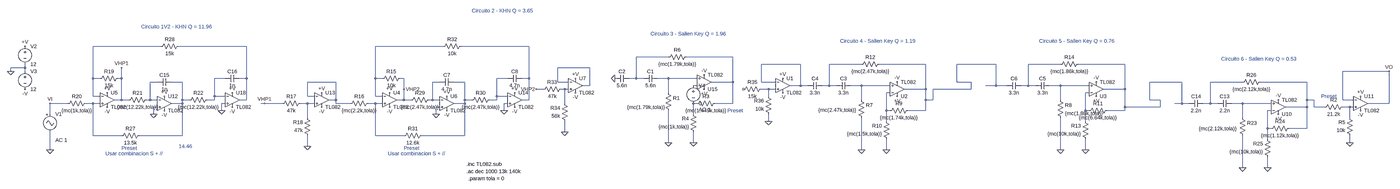
[diagram p0: schematic FiltroHP_N10_MC.asc, whole sheet]
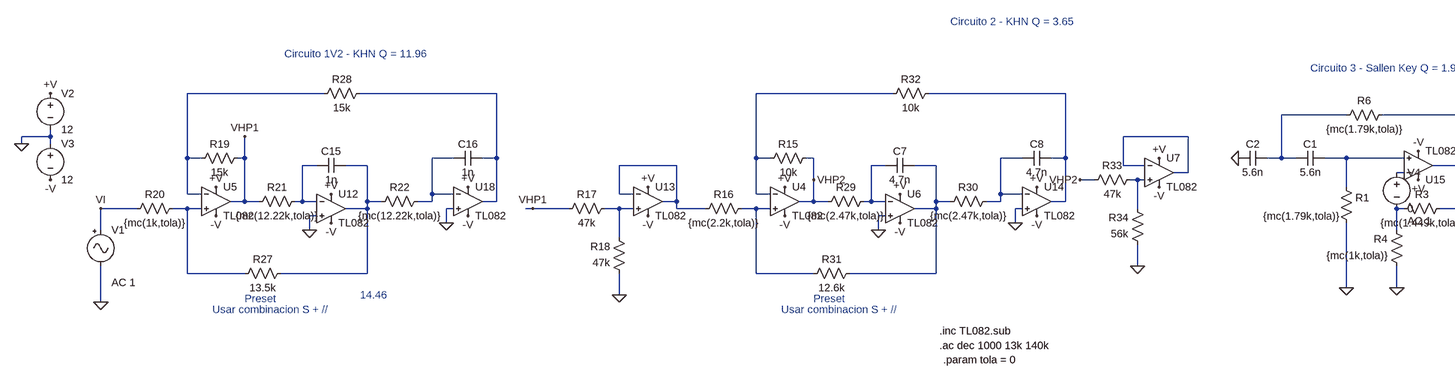
[diagram p1: schematic FiltroHP_N10_MC.asc, part, row 1 of 1, column 1 of 2]
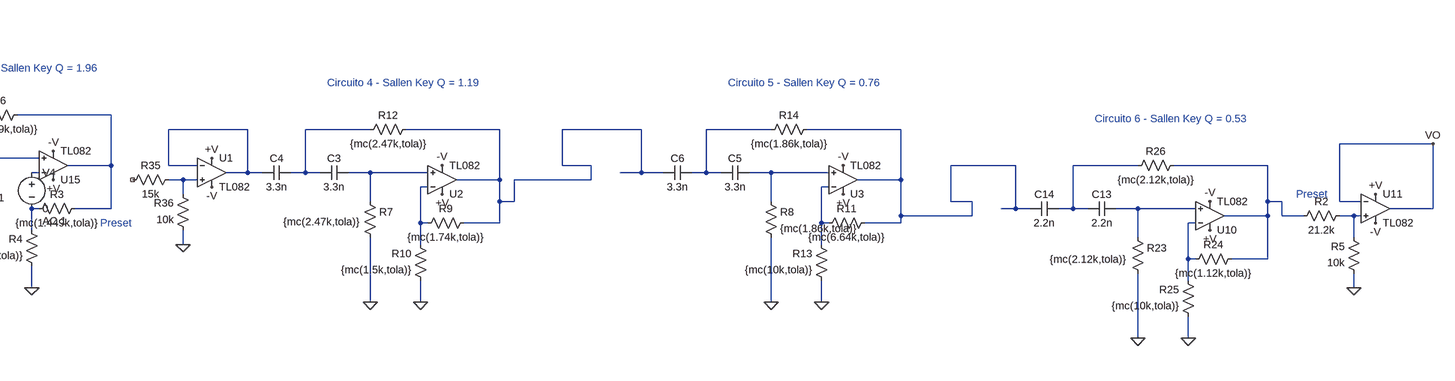
[diagram p2: schematic FiltroHP_N10_MC.asc, part, row 1 of 1, column 2 of 2]
FiltroHP_N10_MC.asc, the LTspice schematic file:
Version 4
SHEET 1 5208 1092
WIRE -912 0 -1216 0
WIRE -528 0 -832 0
WIRE 352 0 48 0
WIRE 736 0 432 0
WIRE 1360 48 1216 48
WIRE 1648 48 1440 48
WIRE 1952 80 1776 80
WIRE 2224 80 2080 80
WIRE 2512 80 2304 80
WIRE 2832 80 2656 80
WIRE 3120 80 2976 80
WIRE 3408 80 3200 80
WIRE -1520 96 -1520 80
WIRE -1520 96 -1584 96
WIRE 1008 96 864 96
WIRE -1584 112 -1584 96
WIRE -1520 112 -1520 96
WIRE 4656 112 4448 112
WIRE -1216 144 -1216 0
WIRE -1184 144 -1216 144
WIRE -1088 144 -1088 96
WIRE -1088 144 -1104 144
WIRE -624 144 -672 144
WIRE -528 144 -528 0
WIRE -528 144 -560 144
WIRE 48 144 48 0
WIRE 80 144 48 144
WIRE 176 144 160 144
WIRE 640 144 592 144
WIRE 736 144 736 0
WIRE 736 144 704 144
WIRE 1216 144 1216 48
WIRE 1216 144 1184 144
WIRE 1248 144 1216 144
WIRE 1360 144 1312 144
WIRE 1488 144 1360 144
WIRE -928 160 -960 160
WIRE -816 160 -864 160
WIRE -128 160 -256 160
WIRE 336 160 304 160
WIRE 448 160 400 160
WIRE 864 160 864 96
WIRE 912 160 864 160
WIRE 1648 160 1648 48
WIRE 1648 160 1552 160
WIRE 1776 160 1776 80
WIRE 1840 160 1776 160
WIRE 2656 160 2656 80
WIRE 2720 160 2656 160
WIRE 3728 160 3584 160
WIRE 4000 160 3856 160
WIRE 4288 160 4080 160
WIRE 1008 176 1008 96
WIRE 1008 176 976 176
WIRE 1488 176 1472 176
WIRE 1952 176 1952 80
WIRE 1952 176 1904 176
WIRE 1984 176 1952 176
WIRE 2080 176 2080 80
WIRE 2080 176 2048 176
WIRE 2112 176 2080 176
WIRE 2224 176 2176 176
WIRE 2352 176 2224 176
WIRE 2832 176 2832 80
WIRE 2832 176 2784 176
WIRE 2880 176 2832 176
WIRE 2976 176 2976 80
WIRE 2976 176 2944 176
WIRE 3008 176 2976 176
WIRE 3120 176 3072 176
WIRE 3248 176 3120 176
WIRE 176 192 176 144
WIRE 800 192 768 192
WIRE 896 192 880 192
WIRE 912 192 896 192
WIRE 1808 192 1776 192
WIRE 1840 192 1808 192
WIRE 2512 192 2512 80
WIRE 2512 192 2416 192
WIRE 2720 192 2720 160
WIRE 2720 192 2544 192
WIRE 3408 192 3408 80
WIRE 3408 192 3312 192
WIRE 1360 208 1360 144
WIRE 2352 208 2336 208
WIRE 3248 208 3232 208
WIRE -1216 224 -1216 144
WIRE -1184 224 -1216 224
WIRE -672 224 -672 144
WIRE -624 224 -672 224
WIRE -256 224 -256 160
WIRE -224 224 -256 224
WIRE 48 224 48 144
WIRE 80 224 48 224
WIRE 592 224 592 144
WIRE 640 224 592 224
WIRE 1808 224 1808 192
WIRE -1088 240 -1088 144
WIRE -1088 240 -1120 240
WIRE -1056 240 -1088 240
WIRE -960 240 -960 160
WIRE -960 240 -976 240
WIRE -928 240 -960 240
WIRE -816 240 -816 160
WIRE -784 240 -816 240
WIRE -672 240 -672 224
WIRE -672 240 -704 240
WIRE -528 240 -528 144
WIRE -528 240 -560 240
WIRE -128 240 -128 160
WIRE -128 240 -160 240
WIRE 176 240 176 192
WIRE 176 240 144 240
WIRE 208 240 176 240
WIRE 304 240 304 160
WIRE 304 240 288 240
WIRE 336 240 304 240
WIRE 448 240 448 160
WIRE 480 240 448 240
WIRE 592 240 592 224
WIRE 592 240 560 240
WIRE 736 240 736 144
WIRE 736 240 704 240
WIRE 2224 240 2224 176
WIRE 2512 240 2512 192
WIRE 2544 240 2544 192
WIRE 2544 240 2512 240
WIRE 3120 240 3120 176
WIRE 3584 240 3584 160
WIRE 3632 240 3584 240
WIRE 4288 240 4288 160
WIRE 4320 240 4288 240
WIRE 4448 240 4448 112
WIRE 4496 240 4448 240
WIRE -1328 256 -1408 256
WIRE -1216 256 -1248 256
WIRE -1184 256 -1216 256
WIRE -816 256 -816 240
WIRE -816 256 -864 256
WIRE -624 256 -640 256
WIRE -448 256 -464 256
WIRE -368 256 -448 256
WIRE -256 256 -288 256
WIRE -224 256 -256 256
WIRE -128 256 -128 240
WIRE -64 256 -128 256
WIRE 48 256 16 256
WIRE 80 256 48 256
WIRE 448 256 448 240
WIRE 448 256 400 256
WIRE 640 256 624 256
WIRE 896 256 896 192
WIRE 1488 256 1472 256
WIRE 1648 256 1648 160
WIRE 1648 256 1568 256
WIRE 3728 256 3728 160
WIRE 3728 256 3696 256
WIRE 3760 256 3728 256
WIRE 3856 256 3856 160
WIRE 3856 256 3824 256
WIRE 3888 256 3856 256
WIRE 4000 256 3952 256
WIRE 4128 256 4000 256
WIRE 4656 256 4656 112
WIRE 4656 256 4560 256
WIRE -928 272 -944 272
WIRE 336 272 320 272
WIRE 3408 272 3408 192
WIRE 3632 272 3632 240
WIRE 3632 272 3408 272
WIRE 4288 272 4288 240
WIRE 4288 272 4192 272
WIRE 4320 272 4320 240
WIRE 4368 272 4320 272
WIRE 4480 272 4448 272
WIRE 4496 272 4480 272
WIRE -640 288 -640 256
WIRE 624 288 624 256
WIRE 2336 288 2336 208
WIRE 2352 288 2336 288
WIRE 2512 288 2512 240
WIRE 2512 288 2432 288
WIRE 3232 288 3232 208
WIRE 3248 288 3232 288
WIRE 3408 288 3408 272
WIRE 3408 288 3328 288
WIRE 4128 288 4112 288
WIRE -1408 304 -1408 256
WIRE -944 304 -944 272
WIRE 320 304 320 272
WIRE 1472 304 1472 256
WIRE -256 320 -256 256
WIRE 4000 320 4000 256
WIRE 4480 320 4480 272
WIRE 1808 336 1808 304
WIRE 2336 336 2336 288
WIRE 3232 336 3232 288
WIRE 4112 368 4112 288
WIRE 4128 368 4112 368
WIRE 4288 368 4288 272
WIRE 4288 368 4208 368
WIRE 896 384 896 336
WIRE -1216 400 -1216 256
WIRE -1088 400 -1216 400
WIRE -816 400 -816 256
WIRE -816 400 -1008 400
WIRE 48 400 48 256
WIRE 176 400 48 400
WIRE 448 400 448 256
WIRE 448 400 256 400
WIRE 4112 416 4112 368
WIRE 1360 432 1360 288
WIRE 1472 432 1472 384
WIRE 4480 432 4480 400
WIRE -256 448 -256 400
WIRE -1408 464 -1408 384
WIRE 2224 464 2224 320
WIRE 2336 464 2336 416
WIRE 3120 464 3120 320
WIRE 3232 464 3232 416
WIRE 4000 544 4000 400
WIRE 4112 544 4112 496
FLAG 1360 432 0
FLAG 1472 432 0
FLAG 2224 464 0
FLAG 2336 464 0
FLAG 3120 464 0
FLAG 3232 464 0
FLAG -1408 256 VI
FLAG 4000 544 0
FLAG 4112 544 0
FLAG -1408 464 0
FLAG -944 304 0
FLAG -640 288 0
FLAG 320 304 0
FLAG 624 288 0
FLAG 176 192 VHP2
FLAG 768 192 VHP2
FLAG -448 256 VHP1
FLAG 4656 112 VO
FLAG -1088 96 VHP1
FLAG -1584 112 0
FLAG -1520 0 +V
FLAG -1520 192 -V
FLAG -1152 208 +V
FLAG -896 224 +V
FLAG -592 208 +V
FLAG -1152 272 -V
FLAG -896 288 -V
FLAG -592 272 -V
FLAG -192 208 +V
FLAG -192 272 -V
FLAG 112 208 +V
FLAG 368 224 +V
FLAG 672 208 +V
FLAG 112 272 -V
FLAG 368 288 -V
FLAG 672 272 -V
FLAG 944 144 +V
FLAG 944 208 -V
FLAG 1520 192 +V
FLAG 1520 128 -V
FLAG 1872 144 +V
FLAG 1872 208 -V
FLAG 2384 224 +V
FLAG 2384 160 -V
FLAG 3280 224 +V
FLAG 3280 160 -V
FLAG 4160 240 -V
FLAG 4160 304 +V
FLAG 4528 224 +V
FLAG 4528 288 -V
FLAG 4480 432 0
FLAG -256 448 0
FLAG 896 384 0
FLAG 1808 336 0
FLAG 1120 144 0
SYMBOL cap 1312 128 R90
WINDOW 0 0 32 VBottom 2
WINDOW 3 32 32 VTop 2
SYMATTR InstName C1
SYMATTR Value 5.6n
SYMBOL cap 1184 128 R90
WINDOW 0 0 32 VBottom 2
WINDOW 3 32 32 VTop 2
SYMATTR InstName C2
SYMATTR Value 5.6n
SYMBOL res 1344 192 R0
WINDOW 3 -169 81 Left 2
SYMATTR Value {mc(1.79k,tola)}
SYMATTR InstName R1
SYMBOL res 1584 240 R90
WINDOW 0 0 56 VBottom 2
WINDOW 3 32 56 VTop 2
SYMATTR InstName R3
SYMATTR Value {mc(1.449k,tola)}
SYMBOL res 1488 400 R180
WINDOW 0 36 76 Left 2
WINDOW 3 36 40 Left 2
SYMATTR InstName R4
SYMATTR Value {mc(1k,tola)}
SYMBOL res 1344 64 R270
WINDOW 0 32 56 VTop 2
WINDOW 3 0 56 VBottom 2
SYMATTR InstName R6
SYMATTR Value {mc(1.79k,tola)}
SYMBOL cap 2176 160 R90
WINDOW 0 0 32 VBottom 2
WINDOW 3 32 32 VTop 2
SYMATTR InstName C3
SYMATTR Value 3.3n
SYMBOL cap 2048 160 R90
WINDOW 0 0 32 VBottom 2
WINDOW 3 32 32 VTop 2
SYMATTR InstName C4
SYMATTR Value 3.3n
SYMBOL res 2208 224 R0
WINDOW 3 -177 61 Left 2
SYMATTR Value {mc(2.47k,tola)}
SYMATTR InstName R7
SYMBOL res 2448 272 R90
WINDOW 0 0 56 VBottom 2
WINDOW 3 32 56 VTop 2
SYMATTR InstName R9
SYMATTR Value {mc(1.74k,tola)}
SYMBOL res 2352 432 R180
WINDOW 0 36 76 Left 2
WINDOW 3 36 40 Left 2
SYMATTR InstName R10
SYMATTR Value {mc(1.5k,tola)}
SYMBOL res 2208 96 R270
WINDOW 0 32 56 VTop 2
WINDOW 3 0 56 VBottom 2
SYMATTR InstName R12
SYMATTR Value {mc(2.47k,tola)}
SYMBOL cap 3072 160 R90
WINDOW 0 0 32 VBottom 2
WINDOW 3 32 32 VTop 2
SYMATTR InstName C5
SYMATTR Value 3.3n
SYMBOL cap 2944 160 R90
WINDOW 0 0 32 VBottom 2
WINDOW 3 32 32 VTop 2
SYMATTR InstName C6
SYMATTR Value 3.3n
SYMBOL res 3104 224 R0
SYMATTR InstName R8
SYMATTR Value {mc(1.86k,tola)}
SYMBOL res 3344 272 R90
WINDOW 0 0 56 VBottom 2
WINDOW 3 32 56 VTop 2
SYMATTR InstName R11
SYMATTR Value {mc(6.64k,tola)}
SYMBOL res 3248 432 R180
WINDOW 0 36 76 Left 2
WINDOW 3 36 40 Left 2
SYMATTR InstName R13
SYMATTR Value {mc(10k,tola)}
SYMBOL res 3104 96 R270
WINDOW 0 32 56 VTop 2
WINDOW 3 0 56 VBottom 2
SYMATTR InstName R14
SYMATTR Value {mc(1.86k,tola)}
SYMBOL cap 3952 240 R90
WINDOW 0 0 32 VBottom 2
WINDOW 3 32 32 VTop 2
SYMATTR InstName C13
SYMATTR Value 2.2n
SYMBOL cap 3824 240 R90
WINDOW 0 0 32 VBottom 2
WINDOW 3 32 32 VTop 2
SYMATTR InstName C14
SYMATTR Value 2.2n
SYMBOL res 3984 304 R0
WINDOW 3 -180 65 Left 2
SYMATTR Value {mc(2.12k,tola)}
SYMATTR InstName R23
SYMBOL res 4224 352 R90
WINDOW 0 0 56 VBottom 2
WINDOW 3 32 56 VTop 2
SYMATTR InstName R24
SYMATTR Value {mc(1.12k,tola)}
SYMBOL res 4128 512 R180
WINDOW 0 36 76 Left 2
WINDOW 3 36 40 Left 2
SYMATTR InstName R25
SYMATTR Value {mc(10k,tola)}
SYMBOL res 3984 176 R270
WINDOW 0 32 56 VTop 2
WINDOW 3 0 56 VBottom 2
SYMATTR InstName R26
SYMATTR Value {mc(2.12k,tola)}
SYMBOL Misc\\signal -1408 288 R0
WINDOW 123 24 132 Left 2
WINDOW 39 0 0 Left 2
SYMATTR Value2 AC 1
SYMATTR InstName V1
SYMATTR Value ""
SYMBOL res -1088 128 R90
WINDOW 0 0 56 VBottom 2
WINDOW 3 32 56 VTop 2
SYMATTR InstName R19
SYMATTR Value 15k
SYMBOL res -1232 240 R90
WINDOW 0 0 56 VBottom 2
WINDOW 3 32 56 VTop 2
SYMATTR InstName R20
SYMATTR Value {mc(1k,tola)}
SYMBOL res -960 224 R90
WINDOW 0 0 56 VBottom 2
WINDOW 3 32 56 VTop 2
SYMATTR InstName R21
SYMATTR Value {mc(12.22k,tola)}
SYMBOL cap -864 144 R90
WINDOW 0 0 32 VBottom 2
WINDOW 3 32 32 VTop 2
SYMATTR InstName C15
SYMATTR Value 1n
SYMBOL cap -560 128 R90
WINDOW 0 0 32 VBottom 2
WINDOW 3 32 32 VTop 2
SYMATTR InstName C16
SYMATTR Value 1n
SYMBOL res -688 224 R90
WINDOW 0 0 56 VBottom 2
WINDOW 3 32 56 VTop 2
SYMATTR InstName R22
SYMATTR Value {mc(12.22k,tola)}
SYMBOL res -992 384 R90
WINDOW 0 0 56 VBottom 2
WINDOW 3 32 56 VTop 2
SYMATTR InstName R27
SYMATTR Value 13.5k
SYMBOL res -816 -16 R90
WINDOW 0 0 56 VBottom 2
WINDOW 3 32 56 VTop 2
SYMATTR InstName R28
SYMATTR Value 15k
SYMBOL res 176 128 R90
WINDOW 0 0 56 VBottom 2
WINDOW 3 32 56 VTop 2
SYMATTR InstName R15
SYMATTR Value 10k
SYMBOL res 32 240 R90
WINDOW 0 0 56 VBottom 2
WINDOW 3 32 56 VTop 2
SYMATTR InstName R16
SYMATTR Value {mc(2.2k,tola)}
SYMBOL res 304 224 R90
WINDOW 0 0 56 VBottom 2
WINDOW 3 32 56 VTop 2
SYMATTR InstName R29
SYMATTR Value {mc(2.47k,tola)}
SYMBOL cap 400 144 R90
WINDOW 0 0 32 VBottom 2
WINDOW 3 32 32 VTop 2
SYMATTR InstName C7
SYMATTR Value 4.7n
SYMBOL cap 704 128 R90
WINDOW 0 0 32 VBottom 2
WINDOW 3 32 32 VTop 2
SYMATTR InstName C8
SYMATTR Value 4.7n
SYMBOL res 576 224 R90
WINDOW 0 0 56 VBottom 2
WINDOW 3 32 56 VTop 2
SYMATTR InstName R30
SYMATTR Value {mc(2.47k,tola)}
SYMBOL res 272 384 R90
WINDOW 0 0 56 VBottom 2
WINDOW 3 32 56 VTop 2
SYMATTR InstName R31
SYMATTR Value 12.6k
SYMBOL res 448 -16 R90
WINDOW 0 0 56 VBottom 2
WINDOW 3 32 56 VTop 2
SYMATTR InstName R32
SYMATTR Value 10k
SYMBOL Opamps\\opamp2 -1152 176 R0
SYMATTR InstName U5
SYMATTR Value TL082
SYMBOL Opamps\\opamp2 -896 192 R0
SYMATTR InstName U12
SYMATTR Value TL082
SYMBOL Opamps\\opamp2 -592 176 R0
SYMATTR InstName U18
SYMATTR Value TL082
SYMBOL voltage -1520 -16 R0
WINDOW 123 0 0 Left 2
WINDOW 39 0 0 Left 2
SYMATTR InstName V2
SYMATTR Value 12
SYMBOL voltage -1520 96 R0
WINDOW 123 0 0 Left 2
WINDOW 39 0 0 Left 2
SYMATTR InstName V3
SYMATTR Value 12
SYMBOL Opamps\\opamp2 -192 176 R0
SYMATTR InstName U13
SYMATTR Value TL082
SYMBOL Opamps\\opamp2 112 176 R0
SYMATTR InstName U4
SYMATTR Value TL082
SYMBOL Opamps\\opamp2 368 192 R0
SYMATTR InstName U6
SYMATTR Value TL082
SYMBOL Opamps\\opamp2 672 176 R0
SYMATTR InstName U14
SYMATTR Value TL082
SYMBOL Opamps\\opamp2 944 112 R0
SYMATTR InstName U7
SYMATTR Value TL082
SYMBOL Opamps\\opamp2 1520 224 M180
SYMATTR InstName U15
SYMATTR Value TL082
SYMBOL Opamps\\opamp2 1872 112 R0
SYMATTR InstName U1
SYMATTR Value TL082
SYMBOL Opamps\\opamp2 2384 256 M180
SYMATTR InstName U2
SYMATTR Value TL082
SYMBOL Opamps\\opamp2 3280 256 M180
SYMATTR InstName U3
SYMATTR Value TL082
SYMBOL Opamps\\opamp2 4160 336 M180
SYMATTR InstName U10
SYMATTR Value TL082
SYMBOL Opamps\\opamp2 4528 192 R0
SYMATTR InstName U11
SYMATTR Value TL082
SYMBOL res 4464 256 R90
WINDOW 0 0 56 VBottom 2
WINDOW 3 32 56 VTop 2
SYMATTR InstName R2
SYMATTR Value 21.2k
SYMBOL res 4496 416 R180
WINDOW 0 36 76 Left 2
WINDOW 3 36 40 Left 2
SYMATTR InstName R5
SYMATTR Value 10k
SYMBOL res -272 240 R90
WINDOW 0 0 56 VBottom 2
WINDOW 3 32 56 VTop 2
SYMATTR InstName R17
SYMATTR Value 47k
SYMBOL res -240 416 R180
WINDOW 0 36 76 Left 2
WINDOW 3 36 40 Left 2
SYMATTR InstName R18
SYMATTR Value 47k
SYMBOL res 896 176 R90
WINDOW 0 0 56 VBottom 2
WINDOW 3 32 56 VTop 2
SYMATTR InstName R33
SYMATTR Value 47k
SYMBOL res 912 352 R180
WINDOW 0 36 76 Left 2
WINDOW 3 36 40 Left 2
SYMATTR InstName R34
SYMATTR Value 56k
SYMBOL res 1792 176 R90
WINDOW 0 0 56 VBottom 2
WINDOW 3 32 56 VTop 2
SYMATTR InstName R35
SYMATTR Value 15k
SYMBOL res 1824 320 R180
WINDOW 0 36 76 Left 2
WINDOW 3 36 40 Left 2
SYMATTR InstName R36
SYMATTR Value 10k
SYMBOL voltage 1472 160 R0
WINDOW 123 24 124 Left 2
WINDOW 39 0 0 Left 0
SYMATTR InstName V4
SYMATTR Value 0
SYMATTR Value2 AC 1
TEXT 1280 -56 Left 2 ;Circuito 3 - Sallen Key Q = 1.96
TEXT 2128 -24 Left 2 ;Circuito 4 - Sallen Key Q = 1.19
TEXT 3024 -24 Left 2 ;Circuito 5 - Sallen Key Q = 0.76
TEXT -1000 -88 Left 2 ;Circuito 1V2 - KHN Q = 11.96
TEXT 480 -160 Left 2 ;Circuito 2 - KHN Q = 3.65
TEXT 456 560 Left 2 !.ac dec 1000 13k 140k
TEXT 456 528 Left 2 !.inc TL082.sub
TEXT 3904 56 Left 2 ;Circuito 6 - Sallen Key Q = 0.53
TEXT 464 592 Left 2 !.param tola = 0
TEXT -1088 456 Left 2 ;Preset
TEXT 176 456 Left 2 ;Preset
TEXT 1624 288 Left 2 ;Preset
TEXT 4352 224 Left 2 ;Preset
TEXT 104 480 Left 2 ;Usar combinacion S + //
TEXT -1160 480 Left 2 ;Usar combinacion S + //
TEXT -832 448 Left 2 ;14.46

The netlist it stands for:
* FiltroHP_N10_MC.asc
C1 N015 N005 5.6n
C2 N005 0 5.6n
R1 N015 0 {mc(1.79k,tola)}
R3 N006 N033 {mc(1.449k,tola)}
R4 0 N033 {mc(1k,tola)}
R6 N005 N006 {mc(1.79k,tola)}
C3 N024 N008 3.3n
C4 N008 N007 3.3n
R7 N024 0 {mc(2.47k,tola)}
R9 N009 N028 {mc(1.74k,tola)}
R10 0 N028 {mc(1.5k,tola)}
R12 N008 N009 {mc(2.47k,tola)}
C5 N025 N010 3.3n
C6 N010 N009 3.3n
R8 N025 0 {mc(1.86k,tola)}
R11 N011 N029 {mc(6.64k,tola)}
R13 0 N029 {mc(10k,tola)}
R14 N010 N011 {mc(1.86k,tola)}
C13 N034 N021 2.2n
C14 N021 N011 2.2n
R23 N034 0 {mc(2.12k,tola)}
R24 N022 N036 {mc(1.12k,tola)}
R25 0 N036 {mc(10k,tola)}
R26 N021 N022 {mc(2.12k,tola)}
V1 VI 0 AC 1
R19 VHP1 N001 15k
R20 N030 VI {mc(1k,tola)}
R21 N016 VHP1 {mc(12.22k,tola)}
C15 N017 N016 1n
C16 N002 N013 1n
R22 N013 N017 {mc(12.22k,tola)}
R27 N017 N030 13.5k
R28 N002 N001 15k
R15 VHP2 N003 10k
R16 N032 N018 {mc(2.2k,tola)}
R29 N019 VHP2 {mc(2.47k,tola)}
C7 N020 N019 4.7n
C8 N004 N014 4.7n
R30 N014 N020 {mc(2.47k,tola)}
R31 N020 N032 12.6k
R32 N004 N003 10k
XU5 N030 N001 +V -V VHP1 TL082  ; pins In+ In- V+ V- OUT
XU12 0 N016 +V -V N017 TL082  ; pins In+ In- V+ V- OUT
XU18 0 N013 +V -V N002 TL082  ; pins In+ In- V+ V- OUT
V2 +V 0 12
V3 0 -V 12
XU13 N031 N018 +V -V N018 TL082  ; pins In+ In- V+ V- OUT
XU4 N032 N003 +V -V VHP2 TL082  ; pins In+ In- V+ V- OUT
XU6 0 N019 +V -V N020 TL082  ; pins In+ In- V+ V- OUT
XU14 0 N014 +V -V N004 TL082  ; pins In+ In- V+ V- OUT
XU7 N026 N012 +V -V N012 TL082  ; pins In+ In- V+ V- OUT
XU15 N015 N023 +V -V N006 TL082  ; pins In+ In- V+ V- OUT
XU1 N027 N007 +V -V N007 TL082  ; pins In+ In- V+ V- OUT
XU2 N024 N028 +V -V N009 TL082  ; pins In+ In- V+ V- OUT
XU3 N025 N029 +V -V N011 TL082  ; pins In+ In- V+ V- OUT
XU10 N034 N036 +V -V N022 TL082  ; pins In+ In- V+ V- OUT
XU11 N035 VO +V -V VO TL082  ; pins In+ In- V+ V- OUT
R2 N035 N022 21.2k
R5 0 N035 10k
R17 N031 VHP1 47k
R18 0 N031 47k
R33 N026 VHP2 47k
R34 0 N026 56k
R35 N027 NC_01 15k
R36 0 N027 10k
V4 N023 N033 0 AC 1
* Circuito 3 - Sallen Key Q = 1.96
* Circuito 4 - Sallen Key Q = 1.19
* Circuito 5 - Sallen Key Q = 0.76
* Circuito 1V2 - KHN Q = 11.96
* Circuito 2 - KHN Q = 3.65
.ac dec 1000 13k 140k
.inc TL082.sub
* Circuito 6 - Sallen Key Q = 0.53
.param tola = 0
* Preset
* Preset
* Preset
* Preset
* Usar combinacion S + //
* Usar combinacion S + //
* 14.46
.backanno
.end